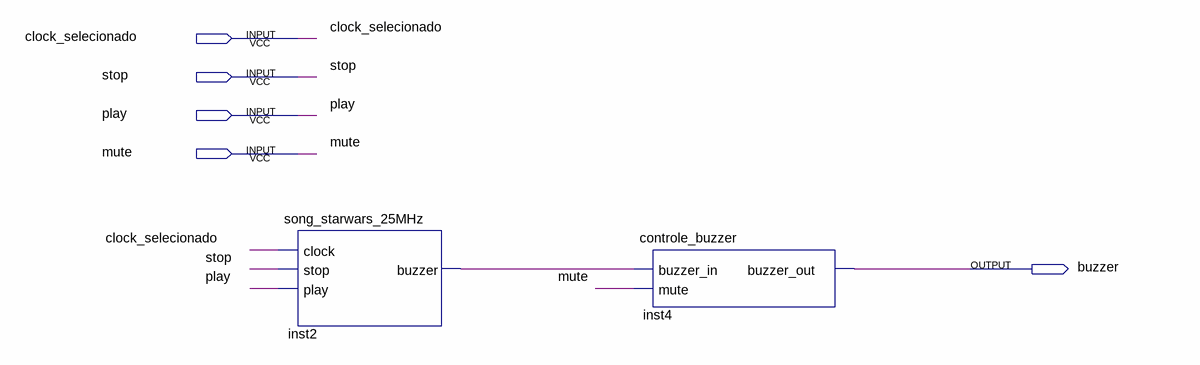
[diagram p0: schematic sheet]
// Quartus schematic modulo_sonoro_bloco.bdf as structural Verilog: 2 symbols, 5 pins
module modulo_sonoro_bloco (
  input  clock_selecionado,
  input  stop,
  input  play,
  input  mute,
  output buzzer
);

  wire inst2_buzzer;

  song_starwars_25MHz inst2 (.clock(clock_selecionado), .play(play), .stop(stop), .buzzer(inst2_buzzer));
  controle_buzzer inst4 (.buzzer_in(inst2_buzzer), .mute(mute), .buzzer_out(buzzer));
endmodule
